# Altium schematic sheet SOCPowerSupplys.SchDoc
size A3; SheetNumber: 5; SheetTotal: 18
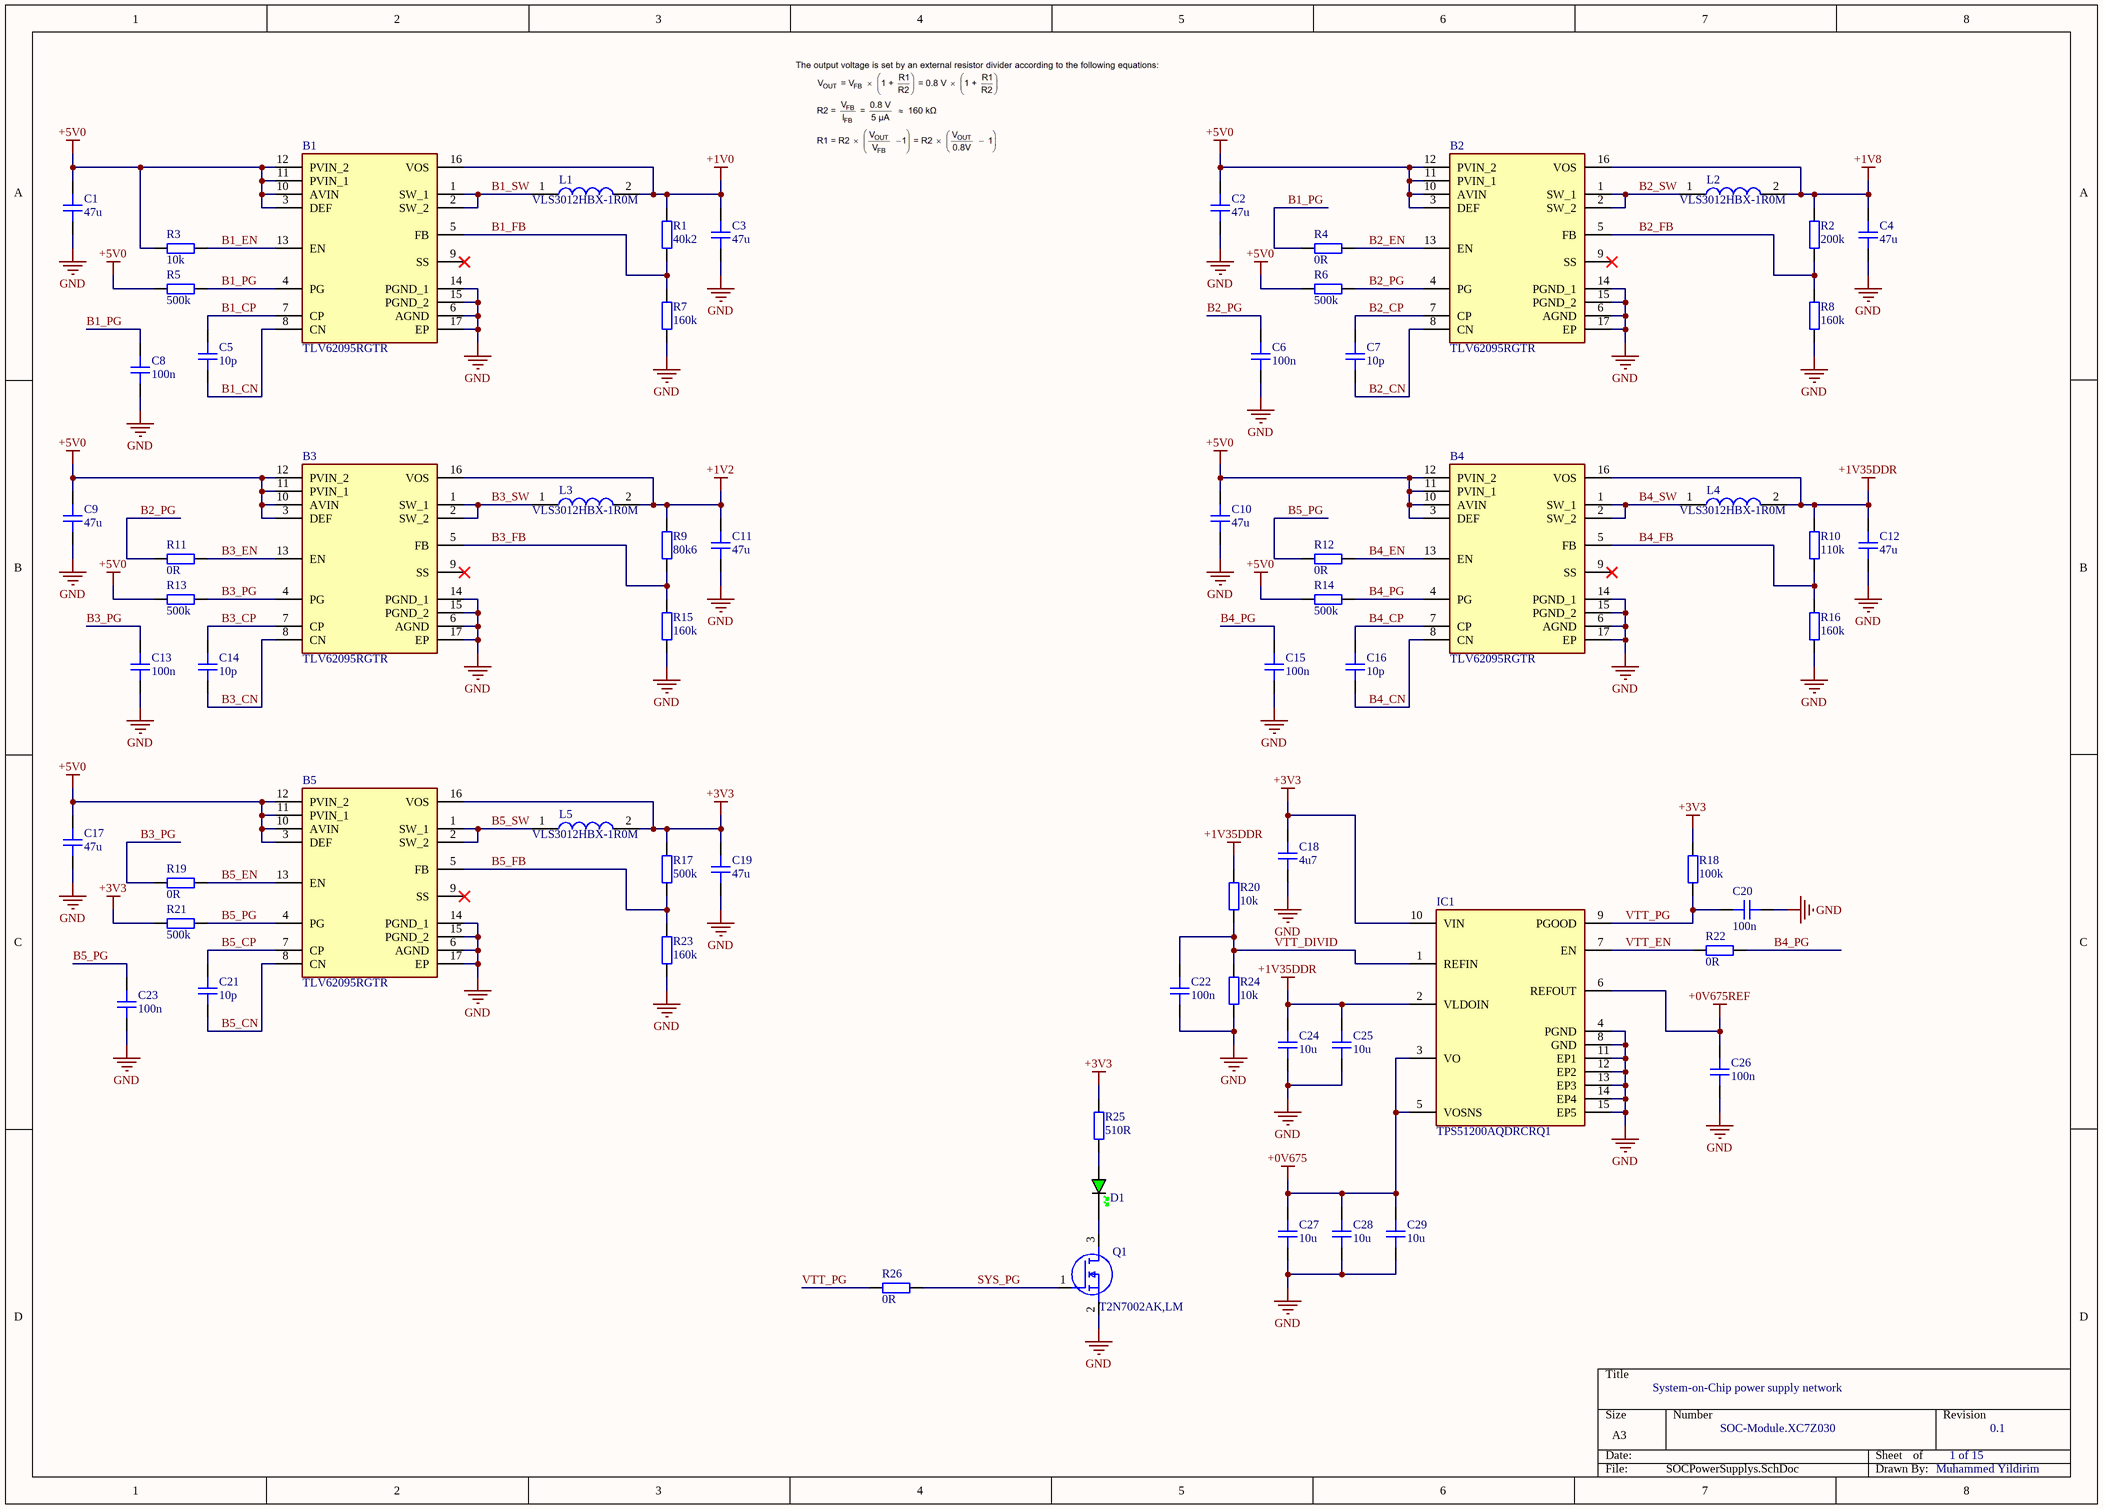
[diagram p0: SOCPowerSupplys.SchDoc]

## Parts
B1  TLV62095RGTR  [QFN50P300X300X100-17N-D]
B2  TLV62095RGTR  [QFN50P300X300X100-17N-D]
B3  TLV62095RGTR  [QFN50P300X300X100-17N-D]
B4  TLV62095RGTR  [QFN50P300X300X100-17N-D]
B5  TLV62095RGTR  [QFN50P300X300X100-17N-D]
C1  47u  [CAP_0805]
C2  47u  [CAP_0805]
C3  47u  [CAP_0805]
C4  47u  [CAP_0805]
C5  10p  [CAP_0402]
C6  100n  [CAP_0402]
C7  10p  [CAP_0402]
C8  100n  [CAP_0402]
C9  47u  [CAP_0805]
C10  47u  [CAP_0805]
C11  47u  [CAP_0805]
C12  47u  [CAP_0805]
C13  100n  [CAP_0402]
C14  10p  [CAP_0402]
C15  100n  [CAP_0402]
C16  10p  [CAP_0402]
C17  47u  [CAP_0805]
C18  4u7  [CAP_0402]
C19  47u  [CAP_0805]
C20  100n  [CAP_0402]
C21  10p  [CAP_0402]
C22  100n  [CAP_0402]
C23  100n  [CAP_0402]
C24  10u  [CAP_0603]
C25  10u  [CAP_0603]
C26  100n  [CAP_0402]
C27  10u  [CAP_0603]
C28  10u  [CAP_0603]
C29  10u  [CAP_0603]
D1  GREEN  [LED_0603_GREEN]  (value not drawn)
IC1  TPS51200AQDRCRQ1  [TPS51200AQDRCRQ1]
L1  VLS3012HBX-1R0M  [VLS3012]
L2  VLS3012HBX-1R0M  [VLS3012]
L3  VLS3012HBX-1R0M  [VLS3012]
L4  VLS3012HBX-1R0M  [VLS3012]
L5  VLS3012HBX-1R0M  [VLS3012]
Q1  T2N7002AK,LM  [TBAT54CLM]
R1  40k2  [RES_0402]
R2  200k  [RES_0402]
R3  10k  [RES_0402]
R4  0R  [RES_0402]
R5  500k  [RES_0402]
R6  500k  [RES_0402]
R7  160k  [RES_0402]
R8  160k  [RES_0402]
R9  80k6  [RES_0402]
R10  110k  [RES_0402]
R11  0R  [RES_0402]
R12  0R  [RES_0402]
R13  500k  [RES_0402]
R14  500k  [RES_0402]
R15  160k  [RES_0402]
R16  160k  [RES_0402]
R17  500k  [RES_0402]
R18  100k  [RES_0402]
R19  0R  [RES_0402]
R20  10k  [RES_0402]
R21  500k  [RES_0402]
R22  0R  [RES_0402]
R23  160k  [RES_0402]
R24  10k  [RES_0402]
R25  510R  [RES_0603]
R26  0R  [RES_0402]

## Nets
+0V675: C27.2 C28.2 C29.2 IC1.3(VO) IC1.5(VOSNS)
+0V675REF: C26.2 IC1.6(REFOUT)
+1V0: B1.16(VOS) C3.2 L1.2 R1.2
+1V2: B3.16(VOS) C11.2 L3.2 R9.2
+1V8: B2.16(VOS) C4.2 L2.2 R2.2
+1V35DDR: B4.16(VOS) C12.2 C24.2 C25.2 IC1.2(VLDOIN) L4.2 R10.2 R20.2
+3V3: B5.16(VOS) C18.2 C19.2 IC1.10(VIN) L5.2 R17.2 R18.2 R21.1 R25.2
+5V0: B1.3(DEF) B1.10(AVIN) B1.11(PVIN_1) B1.12(PVIN_2) B2.3(DEF) B2.10(AVIN) B2.11(PVIN_1) B2.12(PVIN_2) B3.3(DEF) B3.10(AVIN) B3.11(PVIN_1) B3.12(PVIN_2) B4.3(DEF) B4.10(AVIN) B4.11(PVIN_1) B4.12(PVIN_2) B5.3(DEF) B5.10(AVIN) B5.11(PVIN_1) B5.12(PVIN_2) C1.2 C2.2 C9.2 C10.2 C17.2 R3.1 R5.1 R6.1 R13.1 R14.1
GND: B1.6(AGND) B1.14(PGND_1) B1.15(PGND_2) B1.17(EP) B2.6(AGND) B2.14(PGND_1) B2.15(PGND_2) B2.17(EP) B3.6(AGND) B3.14(PGND_1) B3.15(PGND_2) B3.17(EP) B4.6(AGND) B4.14(PGND_1) B4.15(PGND_2) B4.17(EP) B5.6(AGND) B5.14(PGND_1) B5.15(PGND_2) B5.17(EP) C1.1 C2.1 C3.1 C4.1 C6.1 C8.1 C9.1 C10.1 C11.1 C12.1 C13.1 C15.1 C17.1 C18.1 C19.1 C20.1 C22.1 C23.1 C24.1 C25.1 C26.1 C27.1 C28.1 C29.1 IC1.4(PGND) IC1.8(GND) IC1.11(EP1) IC1.12(EP2) IC1.13(EP3) IC1.14(EP4) IC1.15(EP5) Q1.2(S) R7.1 R8.1 R15.1 R16.1 R23.1 R24.1
B1_CN: B1.8(CN) C5.1
B1_CP: B1.7(CP) C5.2
B1_EN: B1.13(EN) R3.2
B1_FB: B1.5(FB) R1.1 R7.2
B1_PG: B1.4(PG) C8.2 R4.2 R5.2
B1_SW: B1.1(SW_1) B1.2(SW_2) L1.1
B2_CN: B2.8(CN) C7.1
B2_CP: B2.7(CP) C7.2
B2_EN: B2.13(EN) R4.1
B2_FB: B2.5(FB) R2.1 R8.2
B2_PG: B2.4(PG) C6.2 R6.2 R11.2
B2_SW: B2.1(SW_1) B2.2(SW_2) L2.1
B3_CN: B3.8(CN) C14.1
B3_CP: B3.7(CP) C14.2
B3_EN: B3.13(EN) R11.1
B3_FB: B3.5(FB) R9.1 R15.2
B3_PG: B3.4(PG) C13.2 R13.2 R19.2
B3_SW: B3.1(SW_1) B3.2(SW_2) L3.1
B4_CN: B4.8(CN) C16.1
B4_CP: B4.7(CP) C16.2
B4_EN: B4.13(EN) R12.1
B4_FB: B4.5(FB) R10.1 R16.2
B4_PG: B4.4(PG) C15.2 R14.2 R22.1
B4_SW: B4.1(SW_1) B4.2(SW_2) L4.1
B5_CN: B5.8(CN) C21.1
B5_CP: B5.7(CP) C21.2
B5_EN: B5.13(EN) R19.1
B5_FB: B5.5(FB) R17.1 R23.2
B5_PG: B5.4(PG) C23.2 R12.2 R21.2
B5_SW: B5.1(SW_1) B5.2(SW_2) L5.1
SYS_PG: Q1.1(G) R26.1
VTT_DIVID: C22.2 IC1.1(REFIN) R20.1 R24.2
VTT_EN: IC1.7(EN) R22.2
VTT_PG: C20.2 IC1.9(PGOOD) R18.1 R26.2
NetD1_A: D1.A R25.1
NetD1_K: D1.K Q1.3(D)

Not connected (* = marked no-connect by the designer): B1 9(SS)*; B2 9(SS)*; B3 9(SS)*; B4 9(SS)*; B5 9(SS)*

## Notes on the sheet
- System-on-Chip power supply network
- SOC-Module.XC7Z030
- 1 of 15
- 0.1
- Muhammed Yildirim

## Library data of the parts
B1-B5 = TLV62095RGTR: 4A Synchronous Step Down Converter with DCS Control; Manufacturer_Name: Texas Instruments; Geometry.Height: 1mm; Mouser Part Number: 595-TLV62095RGTR; Mouser Price/Stock: https://www.mouser.co.uk/ProductDetail/Texas-Instruments/TLV62095RGTR?qs=f4l5qYp%2Fy%252B5FMQoaGbkQ%252Bg%3D%3D; Manufacturer_Part_Number: TLV62095RGTR; Datasheet Link: http://www.ti.com/lit/gpn/TLV62095
C1-C4 C9-C12 C17 C19 = CAP_0805: Capacitor SMD 0805; Manufacturer: *; Manufacturer Part Number: *; Distributor Link: *; LCSC: *; Rating: *; Dielectric: *
C5-C8 C13-C16 C18 C20-C23 C26 = CAP_0402: Capacitor SMD 0402; Manufacturer: *; Manufacturer Part Number: *; Distributor Link: *; LCSC: *; Rating: *; Dielectric: *
C24 C25 C27-C29 = CAP_0603: Capacitor SMD 0603; Manufacturer: *; Manufacturer Part Number: *; Distributor Link: *; LCSC: *; Rating: *; Dielectric: *
D1 = LED_0603_GREEN: LED 0603 GREEN SMD
IC1 = TPS51200AQDRCRQ1: Texas Instruments Sink and Source DDR Termination Regulator
L1-L5 = VLS3012HBX-1R0M: Inductor; Manufacturer_Name: TDK; Datasheet Link: https://product.tdk.com/system/files/dam/doc/product/inductor/inductor/smd/catalog/inductor_commercial_power_vls3012hbx_en.pdf; Manufacturer_Part_Number: VLS3012HBX-1R0M; Mouser Part Number: 810-VLS3012HBX-1R0M; Mouser Price/Stock: https://www.mouser.co.uk/ProductDetail/TDK/VLS3012HBX-1R0M?qs=pfd5qewlna4O71VRfcrI8g%3D%3D; Arrow Part Number: VLS3012HBX-1R0M; Arrow Price/Stock: https://www.arrow.com/en/products/vls3012hbx-1r0m/tdk?region=nac
Q1 = T2N7002AK,LM: MOSFET (N-Channel); Manufacturer_Name: Toshiba; Datasheet Link: http://toshiba.semicon-storage.com/info/docget.jsp?did=29712&prodName=T2N7002AK; Height: 1.1mm; Manufacturer_Part_Number: T2N7002AK,LM; Mouser Part Number: 757-T2N7002AKLM; Mouser Price/Stock: https://www.mouser.co.uk/ProductDetail/Toshiba/T2N7002AKLM?qs=pzVvXTvk9PzfX4hYglwZ9Q%3D%3D; Arrow Part Number: T2N7002AK,LM; Arrow Price/Stock: https://www.arrow.com/en/products/t2n7002aklm/toshiba?region=nac
R1-R24 R26 = RES_0402: Resistor SMD 0402; Manufacturer: *; Manufacturer Part Number: *; Distributor Link: *; LCSC: *
R25 = RES_0603: Resistor SMD 0603; Manufacturer: *; Manufacturer Part Number: *; Distributor Link: *; LCSC: *